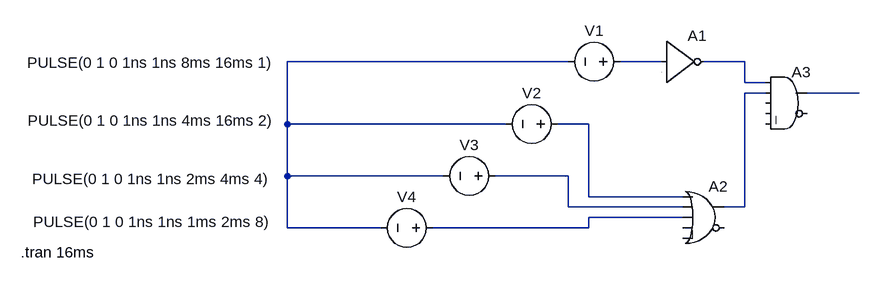
[diagram p0: schematic EXP 12.asc]
EXP 12.asc, the LTspice schematic file:
Version 4
SHEET 1 880 680
WIRE 336 -240 -96 -240
WIRE 480 -240 416 -240
WIRE 608 -240 544 -240
WIRE 608 -208 608 -240
WIRE 640 -208 608 -208
WIRE 640 -192 608 -192
WIRE 784 -192 704 -192
WIRE -96 -144 -96 -240
WIRE 240 -144 -96 -144
WIRE 368 -144 320 -144
WIRE -96 -64 -96 -144
WIRE 144 -64 -96 -64
WIRE 336 -64 224 -64
WIRE 368 -32 368 -144
WIRE 512 -32 368 -32
WIRE 336 -16 336 -64
WIRE 512 -16 336 -16
WIRE 608 -16 608 -192
WIRE 608 -16 576 -16
WIRE 512 0 368 0
WIRE -96 16 -96 -64
WIRE 48 16 -96 16
WIRE 368 16 368 0
WIRE 368 16 128 16
SYMBOL voltage 432 -240 M270
WINDOW 0 32 56 VTop 2
WINDOW 3 14 739 VBottom 2
WINDOW 123 0 0 Left 0
WINDOW 39 0 0 Left 0
SYMATTR InstName V1
SYMATTR Value PULSE(0 1 0 1ns 1ns 8ms 16ms 1)
SYMBOL voltage 336 -144 M270
WINDOW 0 32 56 VTop 2
WINDOW 3 21 642 VBottom 2
WINDOW 123 0 0 Left 0
WINDOW 39 0 0 Left 0
SYMATTR InstName V2
SYMATTR Value PULSE(0 1 0 1ns 1ns 4ms 16ms 2)
SYMBOL voltage 240 -64 M270
WINDOW 0 32 56 VTop 2
WINDOW 3 11 546 VBottom 2
WINDOW 123 0 0 Left 0
WINDOW 39 0 0 Left 0
SYMATTR InstName V3
SYMATTR Value PULSE(0 1 0 1ns 1ns 2ms 4ms 4)
SYMBOL voltage 144 16 M270
WINDOW 0 32 56 VTop 2
WINDOW 3 25 448 VBottom 2
WINDOW 123 0 0 Left 0
WINDOW 39 0 0 Left 0
SYMATTR InstName V4
SYMATTR Value PULSE(0 1 0 1ns 1ns 1ms 2ms 8)
SYMBOL Digital\\or 544 -64 R0
SYMATTR InstName A2
SYMBOL Digital\\and 672 -240 R0
SYMATTR InstName A3
SYMBOL Digital\\inv 480 -304 R0
SYMATTR InstName A1
TEXT -506 54 Left 2 !.tran 16ms

The netlist it stands for:
* EXP 12.asc
V1 N002 N001 PULSE(0 1 0 1ns 1ns 8ms 16ms 1)
V2 N006 N001 PULSE(0 1 0 1ns 1ns 4ms 16ms 2)
V3 N007 N001 PULSE(0 1 0 1ns 1ns 2ms 4ms 4)
V4 N008 N001 PULSE(0 1 0 1ns 1ns 1ms 2ms 8)
A2 N006 N007 N008 0 0 0 N004 0 OR
A3 N003 N004 0 0 0 0 N005 0 AND
A1 N002 0 0 0 0 N003 0 0 BUF
.tran 16ms
.backanno
.end